# EAGLE design Hex BlinkyTile (EAGLE 7.2.0)

## Sheet 1 of 8
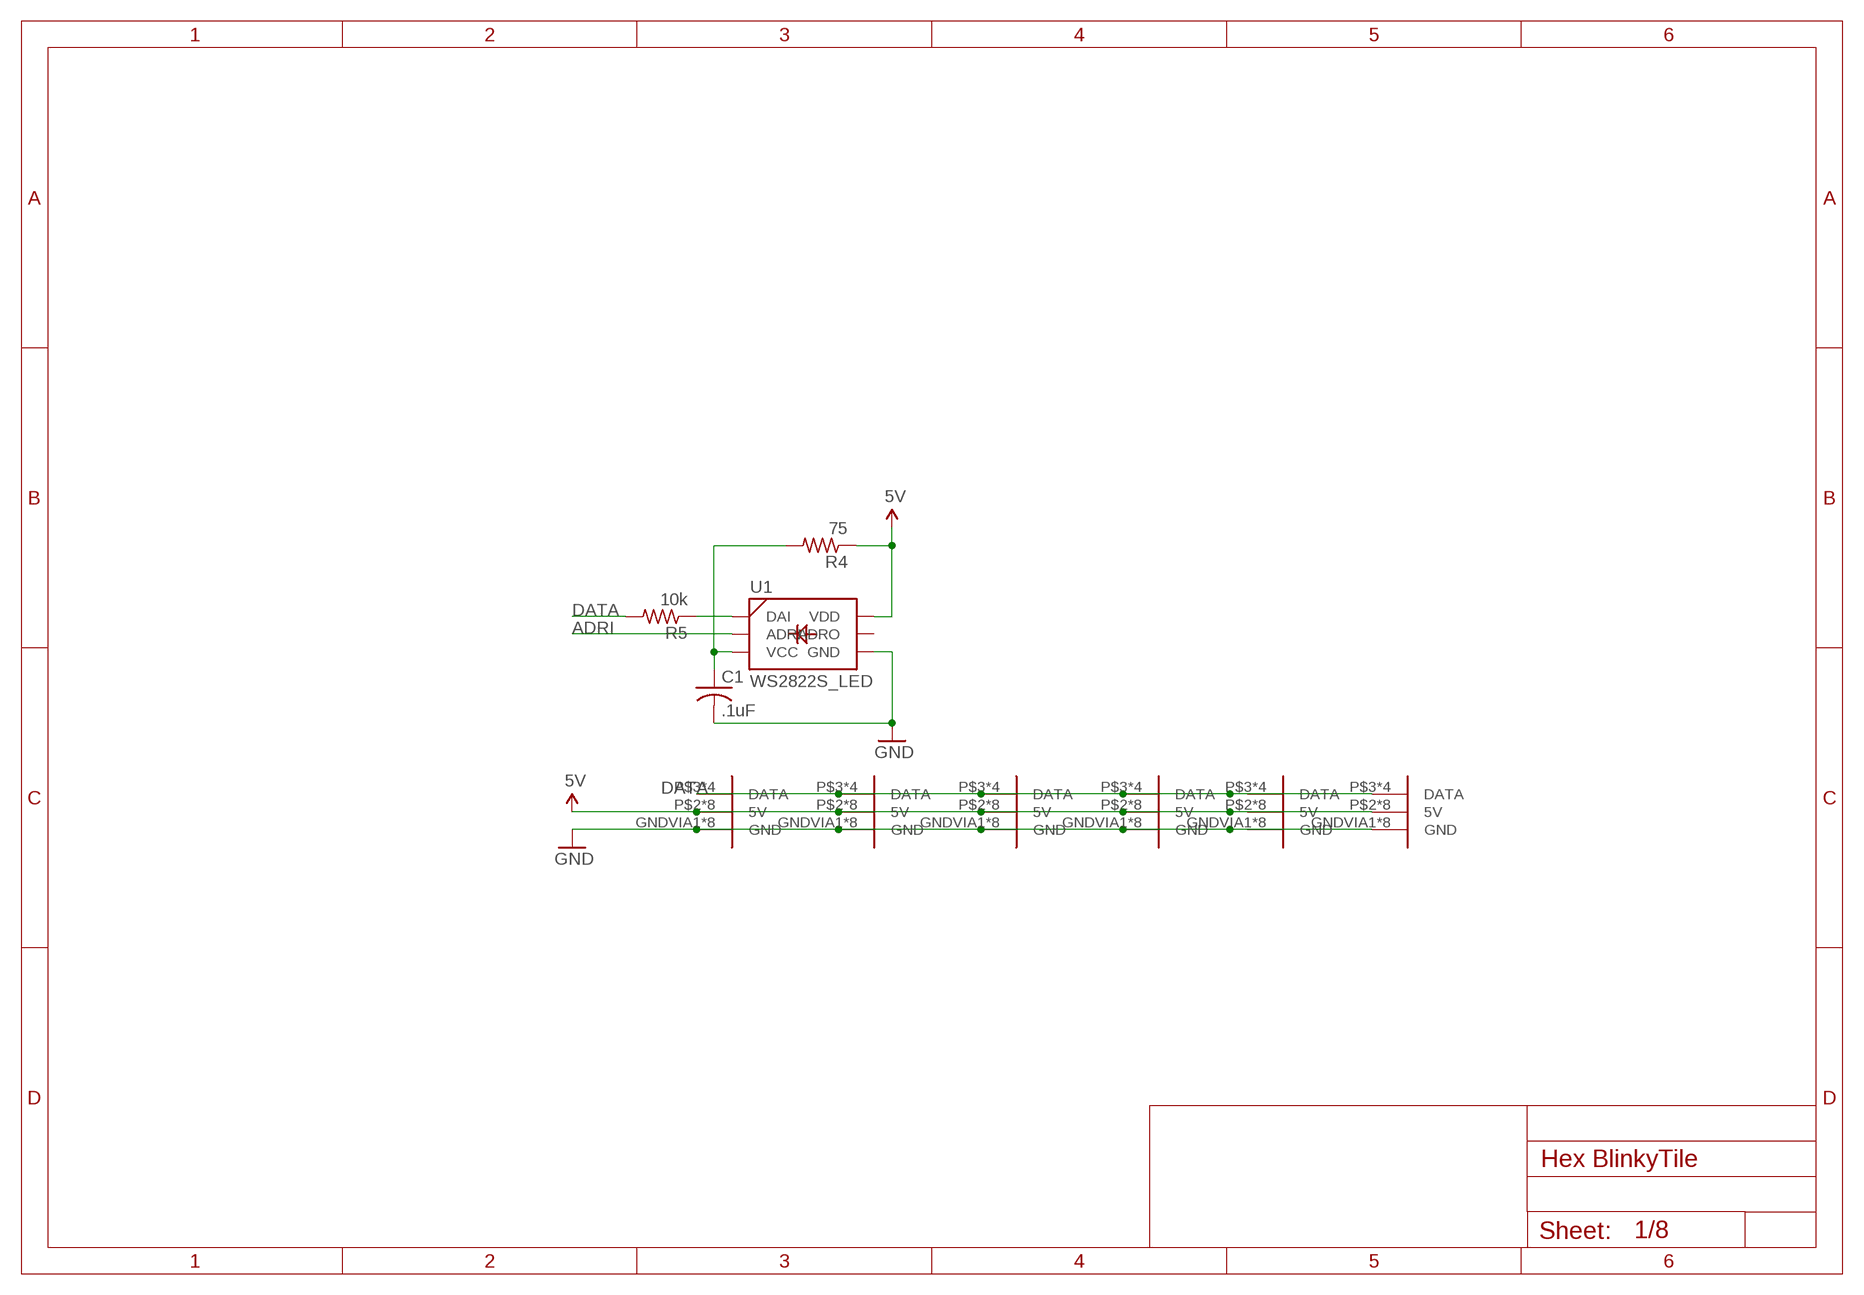
[diagram p0: schematic, sheet 1]

### Parts
C1  .1uF  C-USC0603  [C0603]
R4  75  R-US_R0603  [R0603]
R5  10k  R-US_R0603  [R0603]
U1  WS2822S_LED  [WS2822S_LED]
U$1  D_EDGEMOD  [D_EDGE_SLOT_MOD]
U$2  D_EDGEMOD  [D_EDGE_SLOT_MOD]
U$3  D_EDGEMOD  [D_EDGE_SLOT_MOD]
U$4  D_EDGEMOD  [D_EDGE_SLOT_MOD]
U$5  D_EDGEMOD  [D_EDGE_SLOT_MOD]
U$6  D_EDGEMOD  [D_EDGE_SLOT_MOD]

### Nets
5V: R4.1 U1.6(VDD) U$1.P$2(5V) U$1.P$4(5V) U$1.P$7(5V) U$1.P$9(5V) U$1.PWRVIA1(5V) U$1.PWRVIA3(5V) U$1.PWRVIA4(5V) U$1.PWRVIA6(5V) U$2.P$2(5V) U$2.P$4(5V) U$2.P$7(5V) U$2.P$9(5V) U$2.PWRVIA1(5V) U$2.PWRVIA3(5V) U$2.PWRVIA4(5V) U$2.PWRVIA6(5V) U$3.P$2(5V) U$3.P$4(5V) U$3.P$7(5V) U$3.P$9(5V) U$3.PWRVIA1(5V) U$3.PWRVIA3(5V) U$3.PWRVIA4(5V) U$3.PWRVIA6(5V) U$4.P$2(5V) U$4.P$4(5V) U$4.P$7(5V) U$4.P$9(5V) U$4.PWRVIA1(5V) U$4.PWRVIA3(5V) U$4.PWRVIA4(5V) U$4.PWRVIA6(5V) U$5.P$2(5V) U$5.P$4(5V) U$5.P$7(5V) U$5.P$9(5V) U$5.PWRVIA1(5V) U$5.PWRVIA3(5V) U$5.PWRVIA4(5V) U$5.PWRVIA6(5V) U$6.P$2(5V) U$6.P$4(5V) U$6.P$7(5V) U$6.P$9(5V) U$6.PWRVIA1(5V) U$6.PWRVIA3(5V) U$6.PWRVIA4(5V) U$6.PWRVIA6(5V)
ADRI: U1.2(ADRI)
DATA: R5.2 U$1.P$3(DATA) U$1.P$8(DATA) U$1.SIGVIA1(DATA) U$1.SIGVIA3(DATA) U$2.P$3(DATA) U$2.P$8(DATA) U$2.SIGVIA1(DATA) U$2.SIGVIA3(DATA) U$3.P$3(DATA) U$3.P$8(DATA) U$3.SIGVIA1(DATA) U$3.SIGVIA3(DATA) U$4.P$3(DATA) U$4.P$8(DATA) U$4.SIGVIA1(DATA) U$4.SIGVIA3(DATA) U$5.P$3(DATA) U$5.P$8(DATA) U$5.SIGVIA1(DATA) U$5.SIGVIA3(DATA) U$6.P$3(DATA) U$6.P$8(DATA) U$6.SIGVIA1(DATA) U$6.SIGVIA3(DATA)
GND: C1.2 U1.4(GND) U$1.GNDVIA1(GND) U$1.GNDVIA3(GND) U$1.GNDVIA4(GND) U$1.GNDVIA6(GND) U$1.P$1(GND) U$1.P$5(GND) U$1.P$6(GND) U$1.P$10(GND) U$2.GNDVIA1(GND) U$2.GNDVIA3(GND) U$2.GNDVIA4(GND) U$2.GNDVIA6(GND) U$2.P$1(GND) U$2.P$5(GND) U$2.P$6(GND) U$2.P$10(GND) U$3.GNDVIA1(GND) U$3.GNDVIA3(GND) U$3.GNDVIA4(GND) U$3.GNDVIA6(GND) U$3.P$1(GND) U$3.P$5(GND) U$3.P$6(GND) U$3.P$10(GND) U$4.GNDVIA1(GND) U$4.GNDVIA3(GND) U$4.GNDVIA4(GND) U$4.GNDVIA6(GND) U$4.P$1(GND) U$4.P$5(GND) U$4.P$6(GND) U$4.P$10(GND) U$5.GNDVIA1(GND) U$5.GNDVIA3(GND) U$5.GNDVIA4(GND) U$5.GNDVIA6(GND) U$5.P$1(GND) U$5.P$5(GND) U$5.P$6(GND) U$5.P$10(GND) U$6.GNDVIA1(GND) U$6.GNDVIA3(GND) U$6.GNDVIA4(GND) U$6.GNDVIA6(GND) U$6.P$1(GND) U$6.P$5(GND) U$6.P$6(GND) U$6.P$10(GND)
N$1: C1.1 R4.2 U1.3(VCC)
N$2: R5.1 U1.1(DAI)
Unconnected: U1.5(ADRO)

## Sheet 2 of 8

## Sheet 3 of 8

## Sheet 4 of 8

## Sheet 5 of 8

## Sheet 6 of 8

## Sheet 7 of 8

## Sheet 8 of 8

## Library data of the parts
C1 = adafruit:C-US: CAPACITOR, American symbol
R4 R5 = adafruit:R-US_: RESISTOR, American symbol
U1 = blinkinlabs:WS2822S_LED
U$1-U$6 = dodocohedreled:D_EDGE

## Board
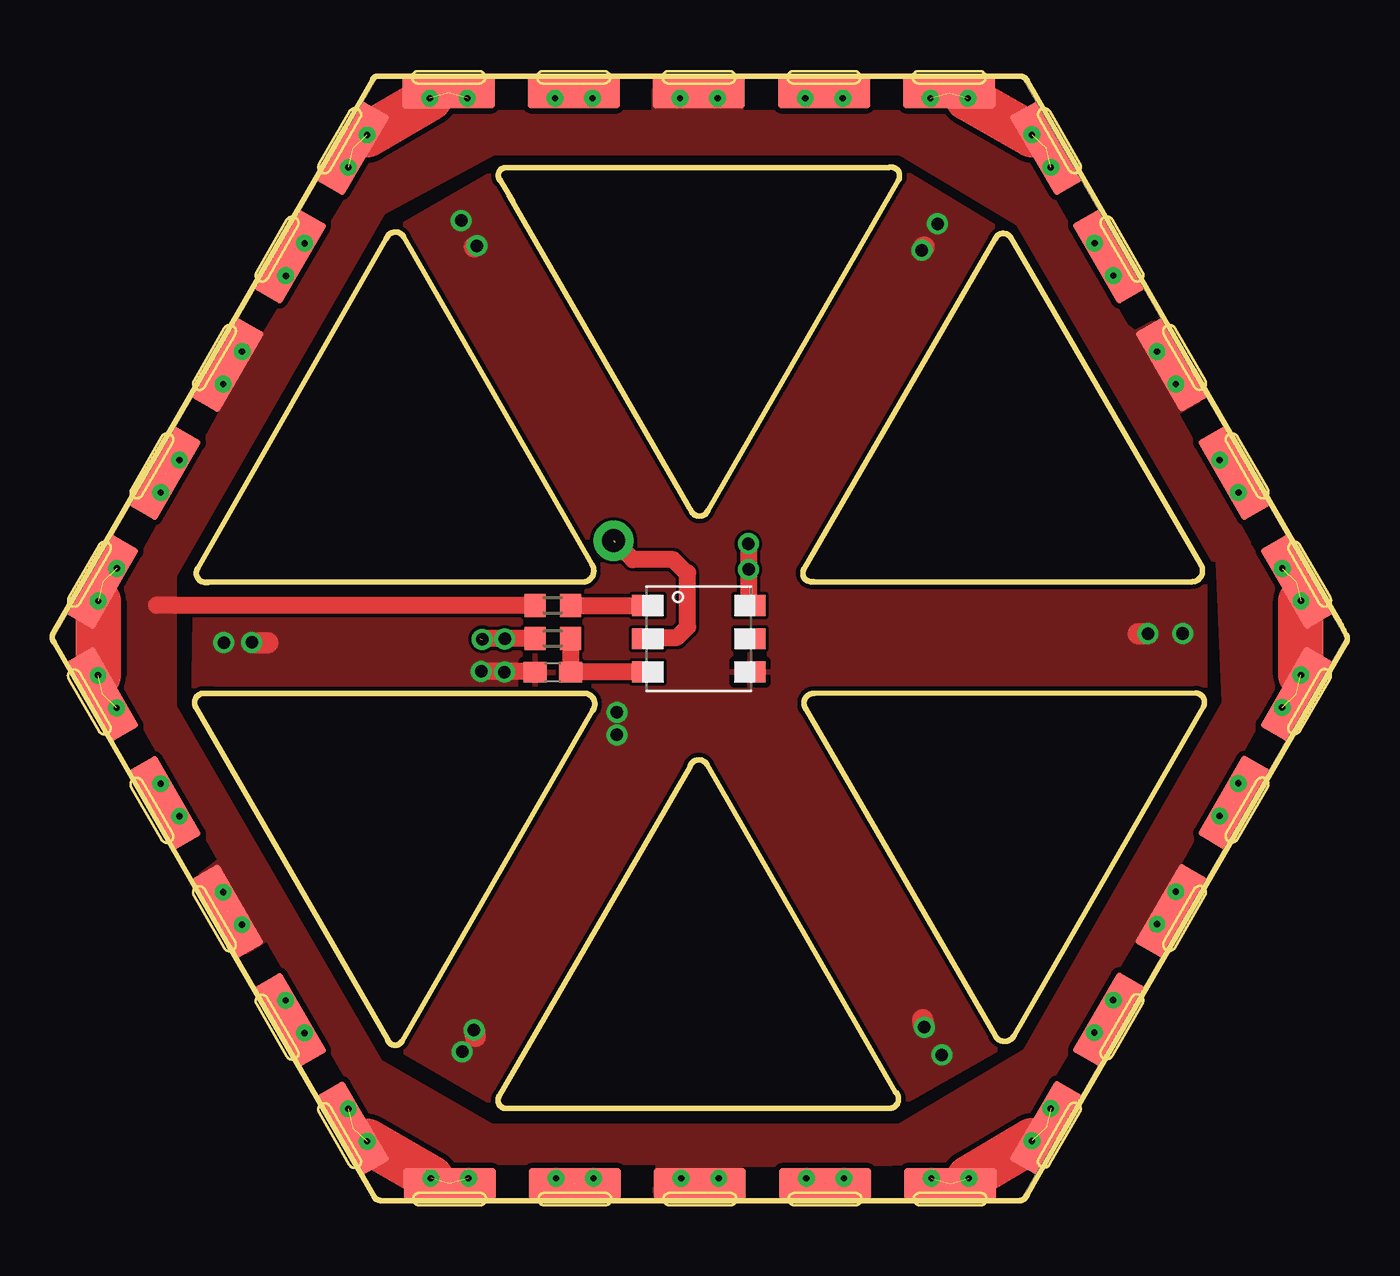
[diagram p1: board, top side]
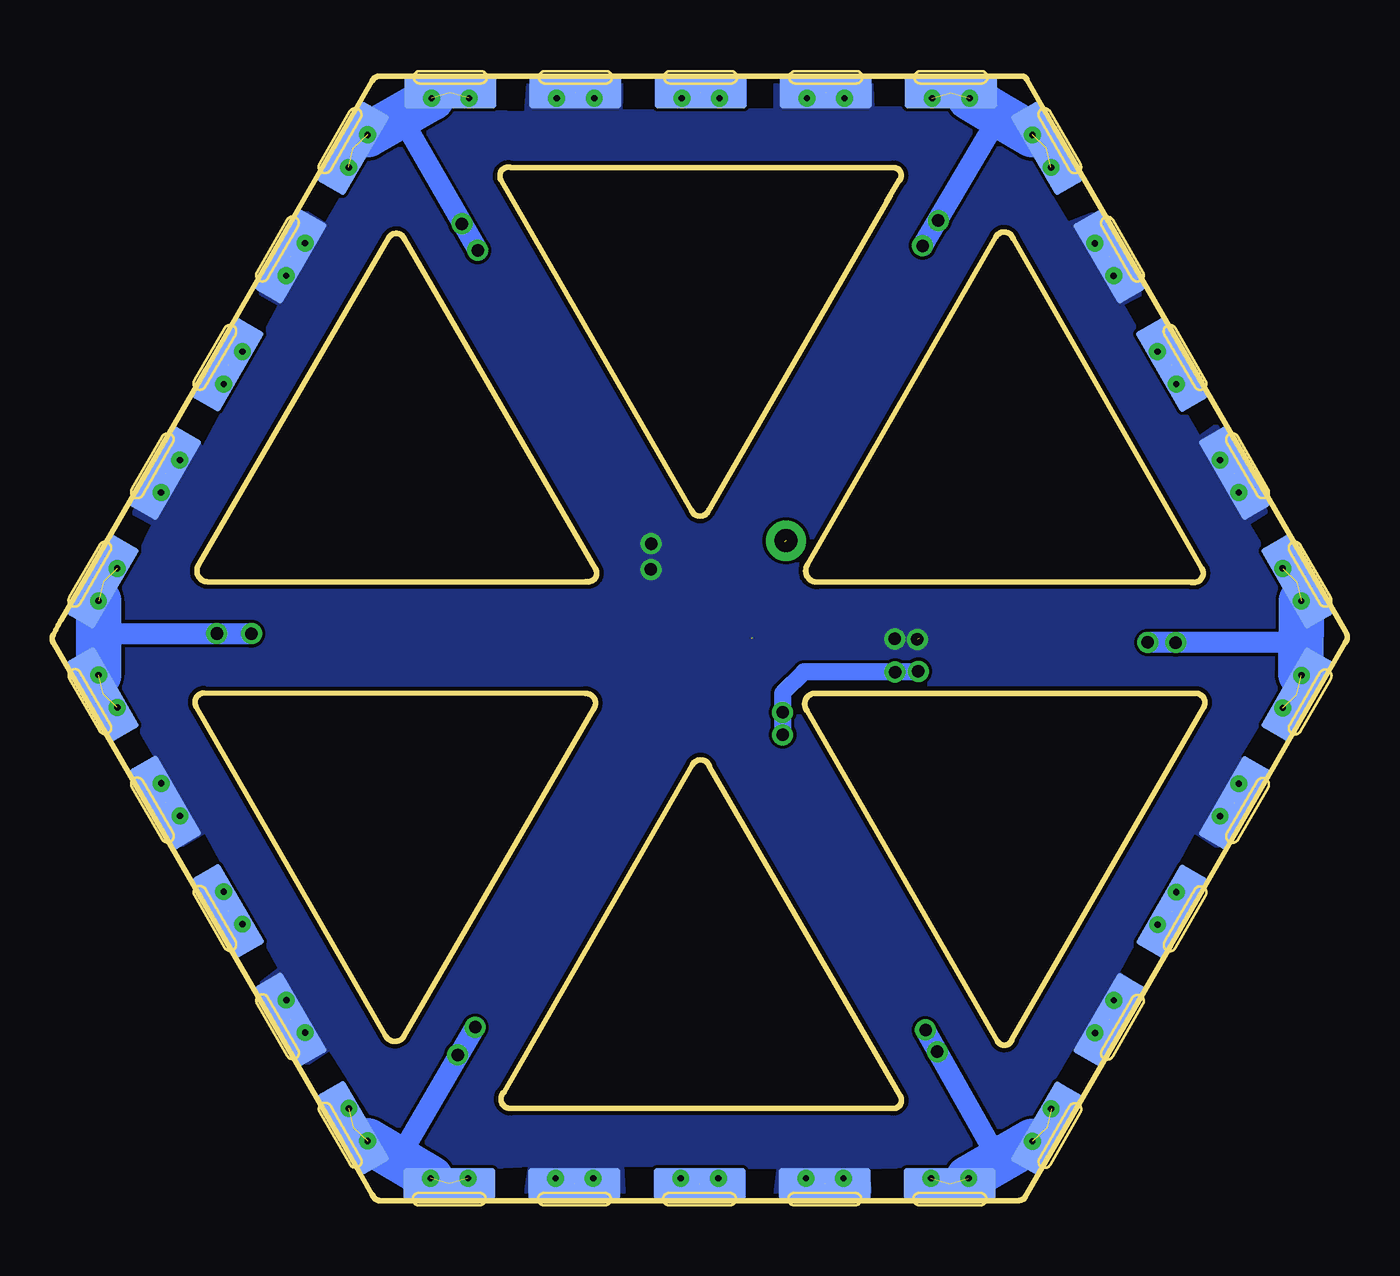
[diagram p2: board, bottom side, seen from below]

Size 62.1 x 53.91 mm. Coordinates in mm from the lower left corner, seen from the top.
Outline: 46.75,0.29 48.28,2.93 62.05,26.76 arc57 62.06,27.12 arc3 61.68,27.82
Outline: 46.4,0 arc66 46.74,0.27
Outline: 61.66,27.84 54.75,39.83 46.76,53.69 arc42 46.5,53.9 15.64,53.9 arc90 15.37,53.74 14.04,51.43 0.11,27.32 0.05,27.21 arc70 0.1,26.76 8.5,12.19 15.38,0.27 15.44,0.18 arc54 15.76,0 46.4,0
Outline: 46.4,0 46.45,0
Outline: 21.92,48.19 30.49,33.32 arc1 30.66,33.03 arc127 31.45,33.09 40.58,48.93 arc137 40.1,49.53 21.77,49.53 arc133 21.49,48.89 22.07,47.94
Outline: 7.4,29.65 25.42,29.65 arc122 25.89,30.49 16.86,46.21 arc134 16.02,46.11 6.97,30.31 arc120 7.36,29.64 arc0 7.49,29.64
Outline: 7.59,24.31 25.23,24.31 25.49,24.32 arc-129 25.92,23.5 16.78,7.64 arc-133 16.08,7.72 6.89,23.66 arc-126 7.32,24.32 arc12 7.64,24.32
Outline: 21.81,4.42 40.14,4.42 arc138 40.44,5.2 31.4,20.91 arc135 30.58,20.8 21.43,5 arc113 21.72,4.42
Outline: 46.13,7.93 55.19,23.67 arc115 54.84,24.34 36.53,24.32 arc126 36.14,23.56 45.22,7.89 arc113 46.08,7.84
Outline: 36.51,29.67 54.63,29.67 arc124 55.07,30.49 45.96,46.17 arc132 45.21,46.09 36.05,30.29 arc133 36.5,29.68
Copper layers (1*16): Top 0.035mm / dielectric 1.5mm / Bottom 0.035mm
Design rules "default *": minimum track width 10mil, minimum drill 24mil, track to track 6mil, track to pad 6mil, pad to pad 6mil, via to via 6mil, smd to smd 6mil, copper to edge 8mil, drill to drill 8mil, minimum pad ring 10mil, minimum via ring 8mil, stop-mask expansion 4mil, vias tented up to drill 0mil, thermal gap 10mil

### Footprints (pad centres in the part's own frame; a part is rotated, then mirrored left to right if it is on the bottom)
C0603 = smd 1.1 x 1: 1 -0.85,0; 2 0.85,0
R0603 = smd 1 x 1.1: 1 -0.85,0; 2 0.85,0
WS2822S_LED = smd 1.5 x 1: 1 -2.45,1.6; 2 -2.45,0; 3 -2.45,-1.6; 4 2.45,-1.6; 5 2.45,0; 6 2.45,1.6
D_EDGE_SLOT_MOD = drill 0.3: GNDVIA1 -12.9,1; GNDVIA3 -11.1,1; GNDVIA4 11.1,1; GNDVIA6 12.9,1; PWRVIA1 -6.9,1; PWRVIA3 -5.1,1; PWRVIA4 5.1,1; PWRVIA6 6.9,1; SIGVIA1 -0.9,1; SIGVIA3 0.9,1 | smd 4.4 x 1.5: P$1 -12,0.73; P$2 -6,0.73; P$3 0,0.73; P$4 6,0.73; P$5 12,0.73 | smd 4.4 x 1.5 bottom: P$6 -12,0.73; P$7 -6,0.73; P$8 0,0.73; P$9 6,0.73; P$10 12,0.73

### Placement (x,y rotation side)
C1  24.01,25.33 180 top
R4  24.01,26.95 0 top
R5  24,28.54 180 top
U1  31.01,26.94 0 top
U$1  7.79,40.42 240 top
U$2  31.01,53.86 180 top
U$3  54.29,40.43 120 top
U$4  54.29,13.53 60 top
U$5  31.06,0.07 0 top
U$6  7.78,13.51 300 top

### Tracks (layer width: path | path; a pad name or v marks a point on that pad's centre or on a via)
5V  (via drill 0.6, 0.6 pad 0.41)  (13 unrouted)
  Top 0.813: v33.38,31.5 33.38,28.62 U1.6 | R4.1 20.51,26.94
  other vias: 33.39,30.26 21.7,26.93 20.62,26.91
  pour Bottom: 2.39,28.39 4.82,32.46 3.57,33.25 5.8,37.46 7.12,36.54 10.86,42.98 9.48,43.7 11.58,47.52 13.42,46.79 16.17,51.4 17.82,52.32 22.8,52.32 22.87,54.03 27.4,53.96 27.4,52.25 34.88,52.19 34.82,53.89 39.22,53.89 39.35,52.12 44.96,52.26 46.19,51.53 48.97,46.75 50.49,47.7 52.66,43.81 51.15,42.96 54.83,36.04 56.44,37.18 58.62,33.2 57.2,32.44 59.56,27.6 59.56,25.52 57.01,21.16 58.43,20.49 56.35,16.8 54.74,17.75 51.15,11.11 52.38,10.16 50.2,6.37 48.78,7.32 45.66,2.39 44.91,1.44 39.14,1.73 39.42,-0.07 34.7,0.02 34.79,1.73 27.23,1.63 27.42,0.12 22.88,0.12 23.07,1.63 17.21,1.82 15.79,2.96 13.14,7.51 11.72,6.47 9.64,9.97 11.06,10.92 7.37,17.75 5.77,16.7 3.69,20.4 5.29,21.25 2.46,25.9 2.55,28.55
ADRI  (via drill 1.1 pad 1.93)  (2 unrouted)
  Top 0.813: 28.55,27 29.96,27 30.47,27.51 30.47,30.1 30.44,30.13 30.37,30.13 29.77,30.73 27.85,30.73 27,31.58
  other vias: 26.92,31.64
DATA  (6 unrouted)
  Top 0.813: R5.2 5.89,28.54 5.01,28.55
  pour Top (isolate 0.254): 5.86,30.03 5.86,23.68 15.71,6.67 21.12,3.57 40.61,3.57 46.64,7.15 56.2,23.89 55.92,30.6 57.44,31.32 58.66,29.38 58.5,24.5 57.79,22.89 53.87,15.88 55.36,15.02 53.51,11.91 51.97,12.69 46.97,4.28 42.74,1.82 32.95,1.71 33.19,0.13 28.85,-0.12 29.07,1.83 19.36,1.82 15.05,4.31 10.3,12.57 8.98,11.7 6.68,15.25 8.06,16.3 3.51,24.35 3.45,29.35 8.32,38.19 6.8,38.83 8.79,42.08 10.16,41.5 15.19,49.74 19.33,52.16 28.86,52.16 28.91,53.72 32.97,53.77 33.02,52.15 42.76,52.16 47.05,49.6 51.47,41.93 51.88,41.61 53.32,42.38 55.33,38.59 53.89,37.76 57.37,31.53 55.68,30.73 46.33,46.85 40.95,50.05 40.57,50.24 21.21,50.24 15.86,47.36 5.88,29.97
GND  (via drill 0.6)  (36 unrouted)
  Top 0.813: 33.42,25.3 U1.4 | C1.2 23.11,25.38 v20.57,25.38
  Top 1.016: v9.57,26.76 10.35,26.75 | v20.37,45.78 20.25,45.72 | v41.7,45.56 arc0 41.8,45.72 | v52.54,27.18 arc-1 52.06,27.17 | v41.82,8.31 arc0 41.74,8.67 | v20.23,8.18 arc1 20.29,7.86
  Top 2.184: U$1.GNDVIA6 U$6.GNDVIA1 | U$6.GNDVIA6 U$5.GNDVIA1 | U$5.GNDVIA6 U$4.GNDVIA1 | U$4.GNDVIA6 U$3.GNDVIA1 | U$3.GNDVIA6 U$2.GNDVIA1 | U$1.GNDVIA1 U$2.GNDVIA6
  Bottom 0.813: v20.57,25.38 20.6,25.35 26.06,25.35 27.08,24.33 v27.08,23.41 27.08,23.21 v27.08,22.33 27.08,22.22
  Bottom 1.016: 2.24,25.24 2.27,26.76 v9.57,26.76 | U$5.GNDVIA1 arc90 17.22,2.01 16.7,2.01 16.63,1.81 v20.23,8.18 | U$4.GNDVIA1 45.52,1.98 v41.82,8.31 | U$3.GNDVIA1 59.82,27.18 v52.54,27.18 | U$3.GNDVIA6 45.4,51.98 v41.7,45.56 | U$2.GNDVIA6 16.67,52.03 | 18.1,52.88 16.74,51.95 v20.37,45.78
  Bottom 2.184: U$1.GNDVIA1 16.67,52.03 18.1,52.88 | U$2.GNDVIA1 U$3.GNDVIA6 | U$3.GNDVIA1 U$4.GNDVIA6 | U$5.GNDVIA6 U$4.GNDVIA1 | U$5.GNDVIA1 U$6.GNDVIA6 | U$1.GNDVIA6 2.24,25.24
  other vias: 8.23,26.75 19.66,7.14 42.66,6.98 54.21,27.19 42.45,46.84 19.62,46.99 21.69,25.34
  pour Top: 6.79,23.74 6.89,29.39 6.88,30.02 16.08,46.35 21.58,49.52 40.5,49.52 45.92,46.25 55.26,30.02 55.26,23.82 45.95,7.62 40.34,4.42 21.52,4.44 16.22,7.52 6.81,23.71
N$1
  Top 0.813: R4.2 C1.1 U1.3
N$2
  Top 0.813: R5.1 U1.1